# EAGLE design GatewayVote_V2.0 (EAGLE 9.6.1)
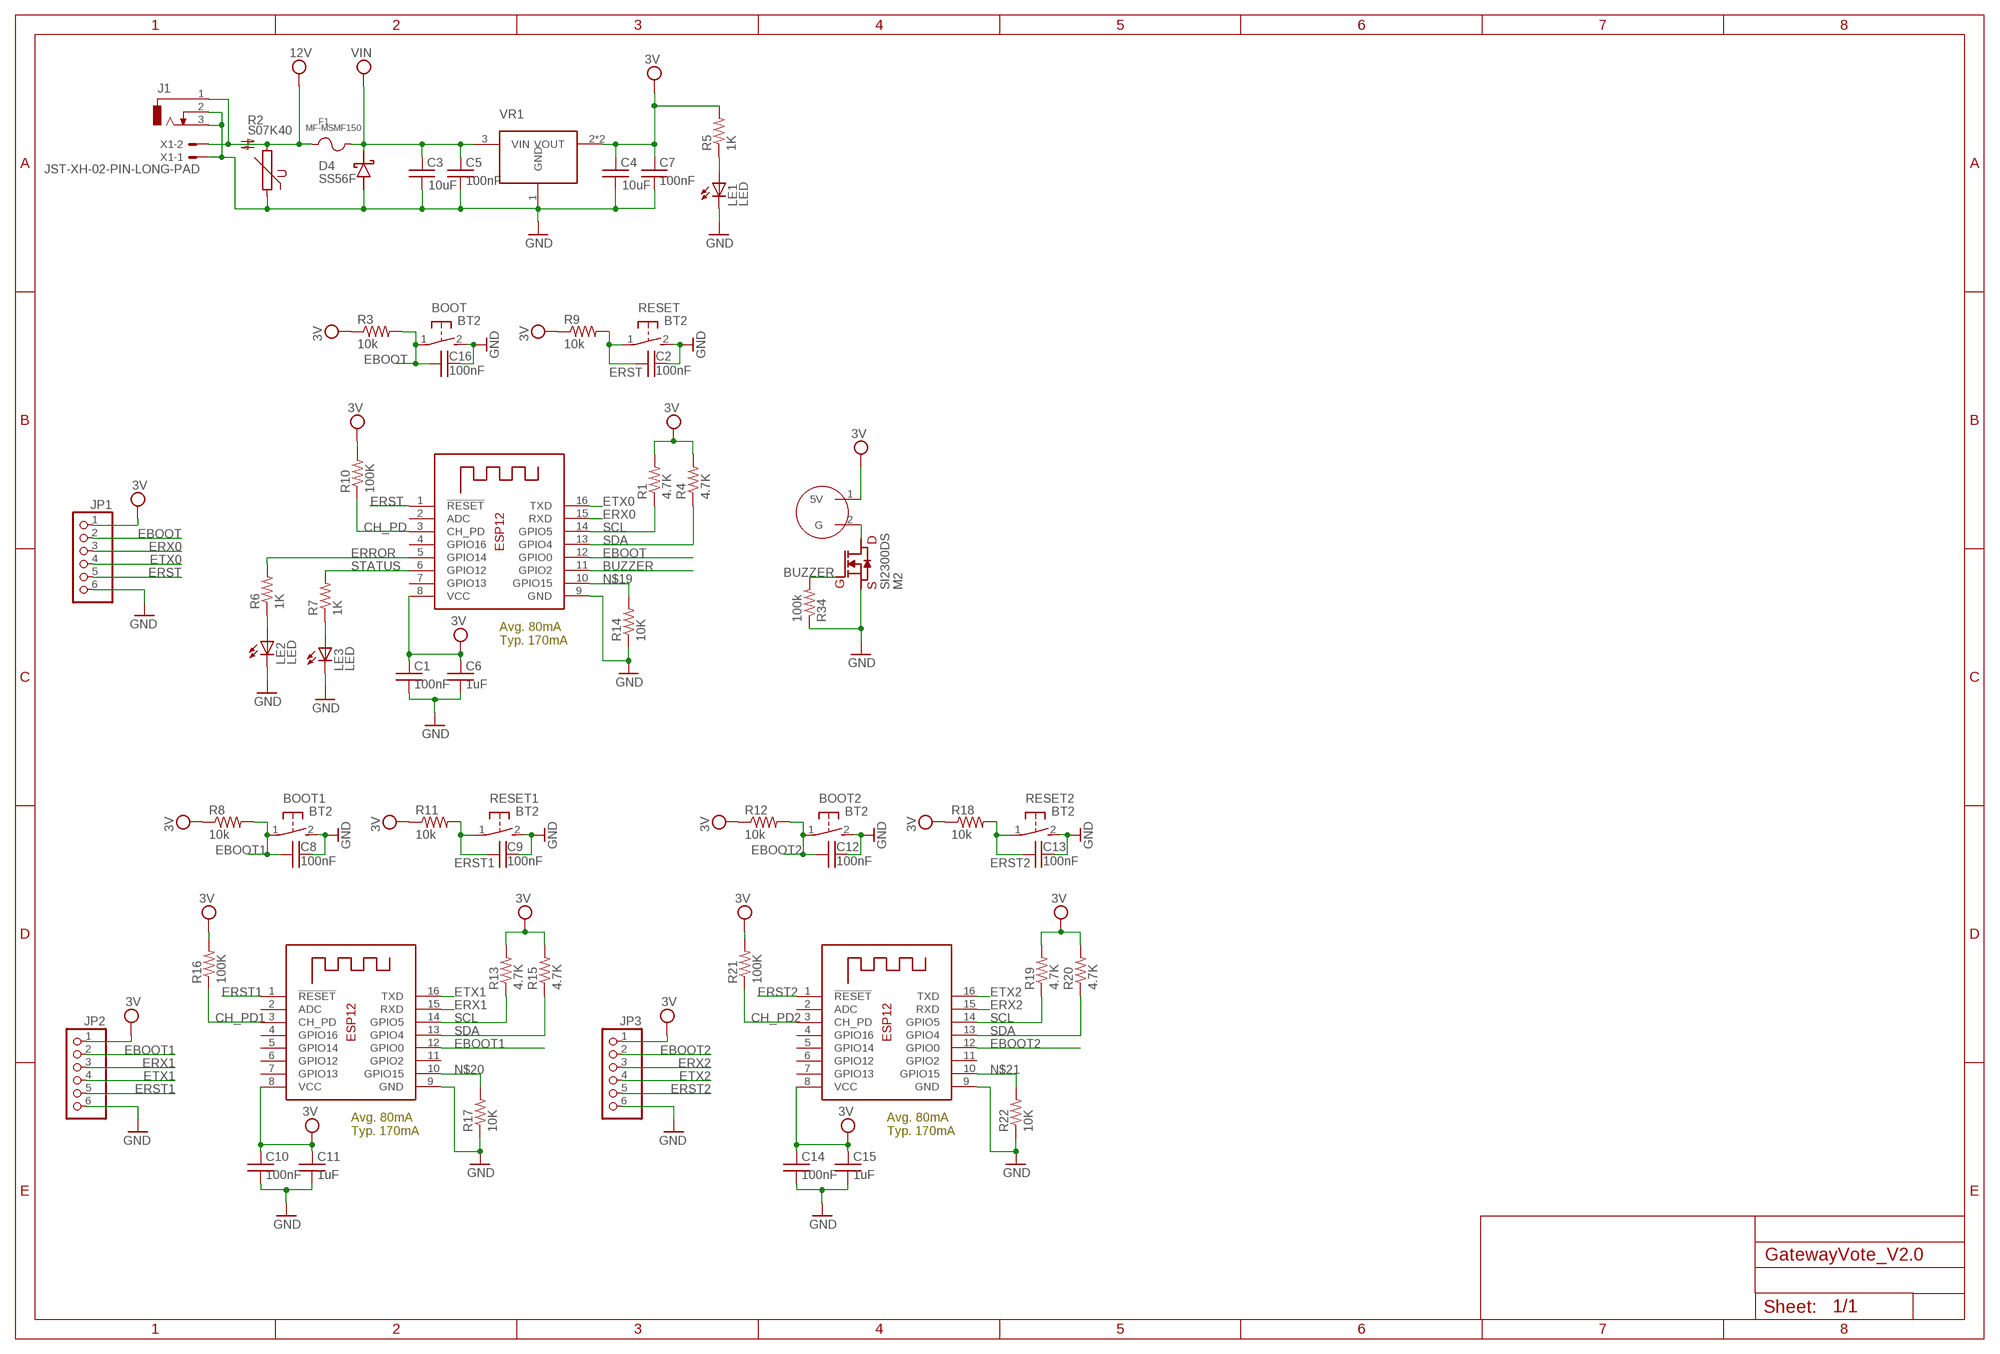
[diagram p0: schematic, sheet 1]

## Parts
BOOT  BT2  [BT2]
BOOT1  BT2  [BT2]
BOOT2  BT2  [BT2]
C1  100nF  C0603  [0603]
C2  100nF  C0603  [0603]
C3  10uF  C0603  [0603]
C4  10uF  C0603  [0603]
C5  100nF  C0603  [0603]
C6  1uF  C0603  [0603]
C7  100nF  C0603  [0603]
C8  100nF  C0603  [0603]
C9  100nF  C0603  [0603]
C10  100nF  C0603  [0603]
C11  1uF  C0603  [0603]
C12  100nF  C0603  [0603]
C13  100nF  C0603  [0603]
C14  100nF  C0603  [0603]
C15  1uF  C0603  [0603]
C16  100nF  C0603  [0603]
D4  SS56F  [SMB]
F1  MF-MSMF150  [FUSER_MF-MSMF150]
J1  DCJ0303  [DCJ0303]
JP1  PINHD-1X6  [1X06]
JP2  PINHD-1X6  [1X06]
JP3  PINHD-1X6  [1X06]
LE1  LED  [LED3MM]
LE2  LED  [LED3MM]
LE3  LED  [LED3MM]
M2  SI2300DS  MOSFETN  [SOT23(1)]
R1  4.7K  R0603  [0603]
R2  S07K40  [S07K40]
R3  10k  R0603  [0603]
R4  4.7K  R0603  [0603]
R5  1K  R0603  [0603]
R6  1K  R0603  [0603]
R7  1K  R0603  [0603]
R8  10k  R0603  [0603]
R9  10k  R0603  [0603]
R10  100K  R0603  [0603]
R11  10k  R0603  [0603]
R12  10k  R0603  [0603]
R13  4.7K  R0603  [0603]
R14  10K  R0603  [0603]
R15  4.7K  R0603  [0603]
R16  100K  R0603  [0603]
R17  10K  R0603  [0603]
R18  10k  R0603  [0603]
R19  4.7K  R0603  [0603]
R20  4.7K  R0603  [0603]
R21  100K  R0603  [0603]
R22  10K  R0603  [0603]
R34  100k  R0603  [0603]
RESET  BT2  [BT2]
RESET1  BT2  [BT2]
RESET2  BT2  [BT2]
U$3  BUZZER-5V  [BUZZER-5V]
VR1  LD1085D2M33R  [VREG_LD1085D2M33R]
X1  JST-XH-02-PIN-LONG-PAD  [JST-XH-02-PACKAGE-LONG-PAD]
X2  ESP-12  [ESP-12]
X3  ESP-12  [ESP-12]
X4  ESP-12  [ESP-12]

## Nets
3V: C1.1 C4.1 C6.1 C7.1 C10.1 C11.1 C14.1 C15.1 JP1.1 JP2.1 JP3.1 R1.2 R3.1 R4.2 R5.2 R8.1 R9.1 R10.2 R11.1 R12.1 R13.2 R15.2 R16.2 R18.1 R19.2 R20.2 R21.2 U$3.1(5V) VR1.2(VOUT) VR1.4(VOUT) X2.8(VCC) X3.8(VCC) X4.8(VCC)
12V: F1.1 J1.1 R2.2 X1.2
BUZZER: M2.1(G) R34.2 X2.11(GPIO2)
CH_PD: R10.1 X2.3(CH_PD)
CH_PD1: R16.1 X3.3(CH_PD)
CH_PD2: R21.1 X4.3(CH_PD)
EBOOT: BOOT.1 C16.1 JP1.2 R3.2 X2.12(GPIO0)
EBOOT1: BOOT1.1 C8.1 JP2.2 R8.2 X3.12(GPIO0)
EBOOT2: BOOT2.1 C12.1 JP3.2 R12.2 X4.12(GPIO0)
ERROR: R6.2 X2.5(GPIO14)
ERST: C2.1 JP1.5 R9.2 RESET.1 X2.1(!RESET)
ERST1: C9.1 JP2.5 R11.2 RESET1.1 X3.1(!RESET)
ERST2: C13.1 JP3.5 R18.2 RESET2.1 X4.1(!RESET)
ERX0: JP1.3 X2.15(RXD)
ERX1: JP2.3 X3.15(RXD)
ERX2: JP3.3 X4.15(RXD)
ETX0: JP1.4 X2.16(TXD)
ETX1: JP2.4 X3.16(TXD)
ETX2: JP3.4 X4.16(TXD)
GND: BOOT1.2 BOOT2.2 BOOT.2 C1.2 C2.2 C3.2 C4.2 C5.2 C6.2 C7.2 C8.2 C9.2 C10.2 C11.2 C12.2 C13.2 C14.2 C15.2 C16.2 D4.A J1.2 J1.3 JP1.6 JP2.6 JP3.6 LE1.K(C) LE2.K(C) LE3.K(C) M2.2(S) R2.1 R14.1 R17.1 R22.1 R34.1 RESET1.2 RESET2.2 RESET.2 VR1.1(GND) X1.1 X2.9(GND) X3.9(GND) X4.9(GND)
N$1: M2.3(D) U$3.2(G)
N$3: LE2.A R6.1
N$5: LE3.A R7.1
N$19: R14.2 X2.10(GPIO15)
N$20: R17.2 X3.10(GPIO15)
N$21: R22.2 X4.10(GPIO15)
N$36: LE1.A R5.1
SCL: R1.1 R13.1 R19.1 X2.14(GPIO5) X3.14(GPIO5) X4.14(GPIO5)
SDA: R4.1 R15.1 R20.1 X2.13(GPIO4) X3.13(GPIO4) X4.13(GPIO4)
STATUS: R7.2 X2.6(GPIO12)
VIN: C3.1 C5.1 D4.C F1.2 VR1.3(VIN)
Unconnected: X2.2(ADC) X2.4(GPIO16) X2.7(GPIO13) X3.2(ADC) X3.4(GPIO16) X3.5(GPIO14) X3.6(GPIO12) X3.7(GPIO13) X3.11(GPIO2) X4.2(ADC) X4.4(GPIO16) X4.5(GPIO14) X4.6(GPIO12) X4.7(GPIO13) X4.11(GPIO2)

## Notes on the sheet
- Avg. 80mA
  Typ. 170mA
- Avg. 80mA
  Typ. 170mA
- Avg. 80mA
  Typ. 170mA

## Library data of the parts
BOOT BOOT1 BOOT2 RESET RESET1 RESET2 = Uy_SMD:BT2
C1 C6 C10 C11 C14 C15 = An:C0603
C2 C8 C9 C12 C13 C16 = Dkoi:C0603
C3-C5 C7 = Dkoi-updated:C0603
D4 = Dkoi:SS56F
F1 = Uy_SMD:MF-MSMF150; AVAILABILITY: Unavailable; DESCRIPTION: Polymeric PTC Resettable Fuse 24V 1.5A Ih Surface Mount 1812 (4532 Metric), Concave; MF: Bourns; MP: MF-MSMF150; PACKAGE: None; PRICE: None
J1 = con-jack:DCJ0303: DC POWER JACK Source: DCJ0303.pdf; OC_FARNELL: unknown; OC_NEWARK: unknown
JP1-JP3 = pinhead:PINHD-1X6: PIN HEADER
LE1-LE3 = Dkoi:LED
M2 = Dkoi:MOSFETN
R1 R4-R7 R10 R13-R17 R19-R22 = Dkoi-updated:R0603
R2 = varistor:S07K40: VARISTOR
R3 R8 R9 R11 R12 R18 R34 = Dkoi:R0603
U$3 = Uy_DIP:BUZZER-5V
VR1 = Uy_SMD:LD1085D2M33R: Check availability <https://pricing.snapeda.com/parts/LD1085D2M33R/STMicroelectronics/view-part?ref=eda>; AVAILABILITY: In Stock; DESCRIPTION: Linear Voltage Regulator IC Positive Fixed 1 Output 3A D2PAK-3; MF: STMicroelectronics; MP: LD1085D2M33R; PACKAGE: D2PAK STMicroelectronics; PRICE: None; PURCHASE-URL: https://pricing.snapeda.com/search?q=LD1085D2M33R&ref=eda
X1 = JST XH Connectors v1-0:JST-XH-02-PIN: JST XH Connector 2 Pin Wire to board connector. Pitch: 2,54 mm, (0.100") Number of pins: 2 Created by Rembrandt Electronics www.rembrandtelectronics.com
X2-X4 = An:ESP-12

## Board
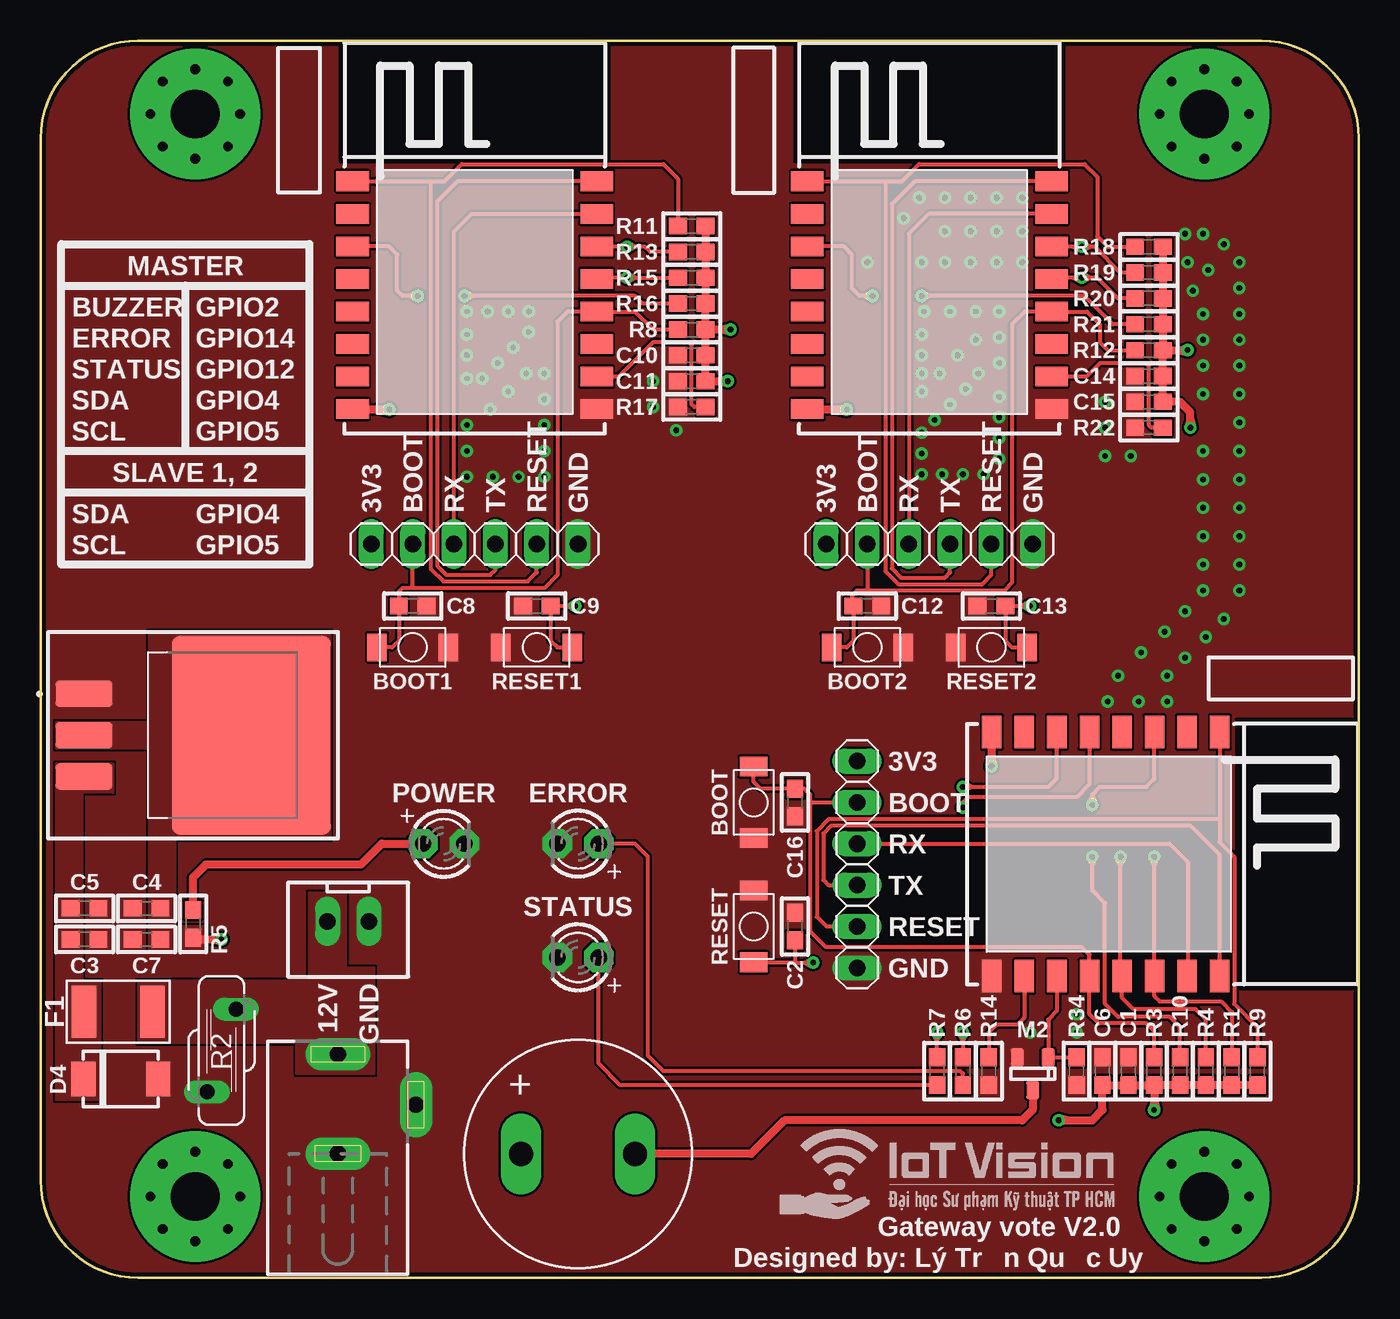
[diagram p1: board, top side]
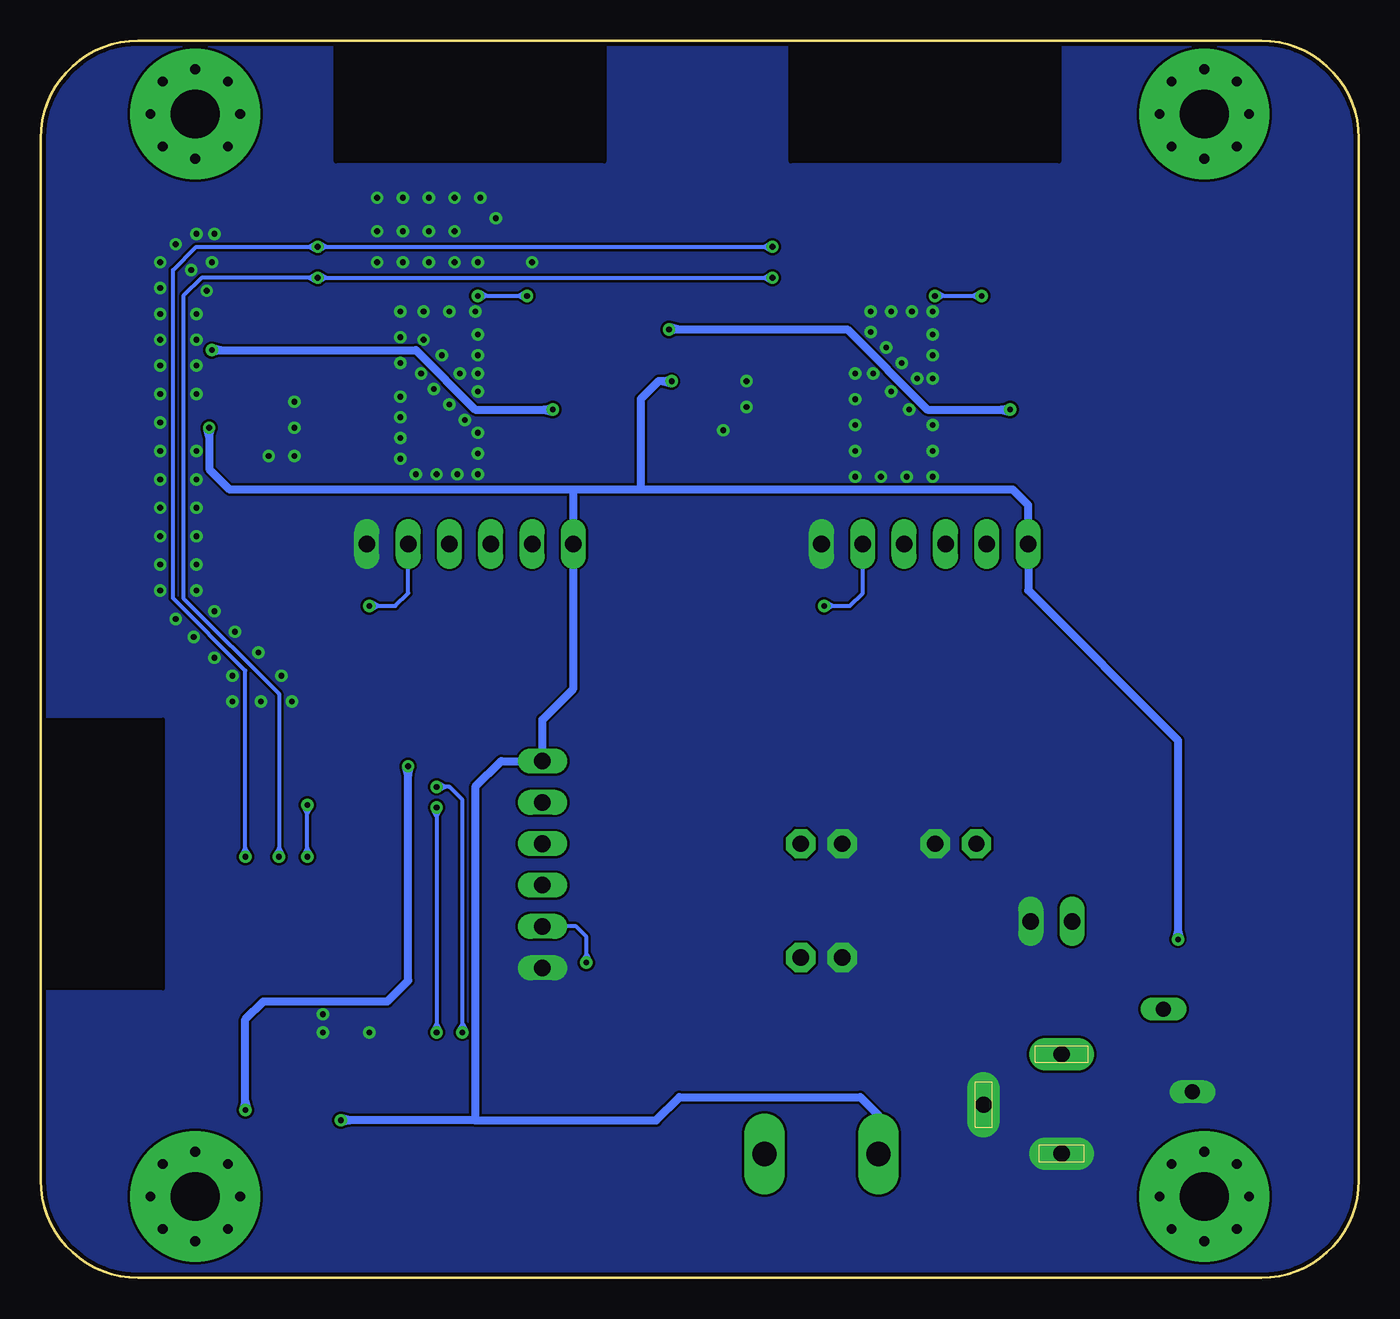
[diagram p2: board, bottom side, seen from below]

Size 81 x 76 mm. Coordinates in mm from the lower left corner, seen from the top.
Outline: 0,70 0,6 arc90 6,0 75,0 arc90 81,6 81,70 arc90 75,76 6,76 arc90 0,70
Copper layers (1*16): Top 0.035mm / dielectric 1.6mm / Bottom 0.035mm
Design rules "Dkoi": minimum track width 0.15mm, minimum drill 0.3mm, track to track 0.15mm, track to pad 0.15mm, pad to pad 0.15mm, via to via 0.15mm, smd to smd 0mil, copper to edge 0.25mm, drill to drill 0.15mm, minimum pad ring 10mil, minimum via ring 8mil, stop-mask expansion 4mil, vias tented up to drill 0.5mm, thermal gap 10mil

### Footprints (pad centres in the part's own frame; a part is rotated, then mirrored left to right if it is on the bottom)
BT2 = smd 1.2 x 1.7: 1 -2.2,0; 2 2.2,0
0603 = smd 1.1 x 1: 1 -0.85,0; 2 0.85,0
SMB = smd 1.5 x 2.1: A -2.3,0; C 2.3,0
FUSER_MF-MSMF150 = smd 1.5 x 3.2: 1 -2.1,0; 2 2.1,0
DCJ0303 = drill 1 pad 2 long: 1 0,3.1; 2 4.8,0; 3 0,-3
1X06 = drill 1.016 long: 1 -6.35,0; 2 -3.81,0; 3 -1.27,0; 4 1.27,0; 5 3.81,0; 6 6.35,0
LED3MM = drill 1 pad 1.8 octagon: A -1.27,0; K 1.27,0
SOT23(1) = smd 0.8 x 1.1: 1 -0.95,-1; 2 0.95,-1; 3 0,1
S07K40 = drill 0.914 long: 1 -0.889,-2.54; 2 0.889,2.54
BUZZER-5V = drill 1.5 pad 2.5 long: 1 -3.5,0; 2 3.5,0
VREG_LD1085D2M33R = smd 3.5 x 1.6: 1 -6.7,2.54; 2 -6.7,0; 3 -6.7,-2.54 | smd 9.75 x 12.2: 4 3.575,0
JST-XH-02-PACKAGE-LONG-PAD = drill 1.016 long: 1 -1.27,0; 2 1.27,0
ESP-12 = smd 2 x 1.2: 1 -7.5,4.5; 2 -7.5,2.5; 3 -7.5,0.5; 4 -7.5,-1.5; 5 -7.5,-3.5; 6 -7.5,-5.5; 7 -7.5,-7.5; 8 -7.5,-9.5; 9 7.5,-9.5; 10 7.5,-7.5; 11 7.5,-5.5; 12 7.5,-3.5; 13 7.5,-1.5; 14 7.5,0.5; 15 7.5,2.5; 16 7.5,4.5

### Placement (x,y rotation side)
BOOT  43.81,29.21 270 top
BOOT1  22.86,38.73 0 top
BOOT2  50.8,38.73 0 top
C1  66.83,12.7 90 top
C2  46.35,21.59 90 top
C3  2.7,20.8 0 top
C4  6.51,22.7 180 top
C5  2.7,22.7 0 top
C6  65.25,12.7 90 top
C7  6.51,20.8 180 top
C8  22.86,41.27 0 top
C9  30.48,41.27 180 top
C10  40.01,56.67 180 top
C11  40.01,55.09 180 top
C12  50.8,41.27 0 top
C13  58.42,41.27 180 top
C14  68.1,55.4 180 top
C15  68.1,53.82 180 top
C16  46.35,29.21 270 top
D4  4.92,12.22 180 top
F1  4.76,16.35 180 top
J1  18.26,10.64 0 top
JP1  50.16,25.4 270 top
JP2  26.67,45.09 0 top
JP3  54.61,45.09 0 top
LE1  24.77,26.67 0 top
LE2  33.02,26.67 180 top
LE3  33.02,19.68 180 top
M2  60.96,12.54 180 top
R1  73.18,12.7 270 top
R2  11.11,13.97 0 top
R3  68.42,12.7 90 top
R4  71.6,12.7 270 top
R5  9.37,21.75 270 top
R6  56.67,12.7 90 top
R7  55.09,12.7 90 top
R8  40.01,58.26 180 top
R9  74.77,12.7 90 top
R10  70.01,12.7 270 top
R11  40.01,64.61 180 top
R12  68.1,56.99 180 top
R13  40.01,63.02 0 top
R14  58.26,12.7 90 top
R15  40.01,61.44 0 top
R16  40.01,59.85 0 top
R17  40.01,53.5 0 top
R18  68.1,63.34 180 top
R19  68.1,61.75 0 top
R20  68.1,60.17 0 top
R21  68.1,58.58 0 top
R22  68.1,52.23 0 top
R34  63.66,12.7 90 top
RESET  43.81,21.59 90 top
RESET1  30.48,38.73 180 top
RESET2  58.42,38.73 180 top
U$2  [1.2MIL]  45.4,3.65 0 top
U$3  33.02,7.62 0 top
VR1  9.37,33.34 0 top
X1  18.89,21.91 180 top
X2  67.94,26.04 270 top
X3  26.67,62.87 0 top
X4  54.61,62.87 0 top

### Tracks (layer width: path | path; a pad name or v marks a point on that pad's centre or on a via)
3V  (via drill 0.35)
  Top 0.5: X2.8 58.42,33.51 58.42,31.96 | 58.42,31.96 v58.42,31.43 | R3.1 R10.2 R4.2 R1.2 R9.1 | R18.1 R19.2 R20.2 R21.2 R12.1 | R12.1 69.96,56.99 | 69.96,56.99 v70.48,56.99 | v49.53,53.34 49.01,53.34 | 49.01,53.34 47.13,53.34 X4.8 | R8.1 C10.1 C11.1 41.7,55.09 | R8.1 R16.2 R15.2 R13.2 R11.1 | 41.7,55.09 v42.23,55.09 | R8.1 41.86,58.26 | 41.86,58.26 v42.39,58.26 | v21.43,53.34 20.91,53.34 | 20.91,53.34 19.2,53.34 X3.8 | v70.64,52.23 70.64,52.75 | 70.64,52.75 70.64,53.18 70.01,53.82 C15.1 C14.1 R12.1 | v62.55,9.68 63.07,9.68 | 63.07,9.68 64.61,9.68 65.25,10.32 C6.1 C1.1 R3.1 | R3.1 68.42,10.84 | 68.42,10.84 v68.42,10.32 | R5.2 9.47,20.8 10.59,20.8 | 10.59,20.8 v11.11,20.8 | 58.42,31.96 58.3,31.46 v58.42,31.43 | 58.42,31.96 58.54,31.46 v58.42,31.43 | 69.96,56.99 70.45,56.87 v70.48,56.99 | 69.96,56.99 70.45,57.12 v70.48,56.99 | 49.01,53.34 49.5,53.22 v49.53,53.34 | 49.01,53.34 49.5,53.46 v49.53,53.34 | 41.7,55.09 42.2,54.96 v42.23,55.09 | 41.7,55.09 42.2,55.21 v42.23,55.09 | 41.86,58.26 42.35,58.14 v42.39,58.26 | 41.86,58.26 42.35,58.39 v42.39,58.26 | 20.91,53.34 21.4,53.22 v21.43,53.34 | 20.91,53.34 21.4,53.46 v21.43,53.34 | 70.64,52.75 70.52,52.26 v70.64,52.23 | 70.64,52.75 70.77,52.26 v70.64,52.23 | 63.07,9.68 62.58,9.81 v62.55,9.68 | 63.07,9.68 62.58,9.56 v62.55,9.68 | 68.42,10.84 68.3,10.35 v68.42,10.32 | 68.42,10.84 68.55,10.35 v68.42,10.32 | 10.59,20.8 11.08,20.67 v11.11,20.8 | 10.59,20.8 11.08,20.92 v11.11,20.8
  Bottom 0.5: 58.42,30.91 58.42,18.26 59.69,16.99 67.31,16.99 68.42,15.88 68.42,10.84 | 58.42,30.91 v58.42,31.43 | 54.29,9.68 54.29,30.16 52.7,31.75 JP1.1 50.16,34.29 48.26,36.2 JP3.1 48.26,48.42 | 54.29,9.68 43.18,9.68 41.75,11.11 30.64,11.11 29.52,9.99 U$3.1 | 44.13,48.42 21.27,48.42 20.32,47.47 JP2.1 20.32,42.23 11.11,33.02 11.11,21.32 | 44.13,48.42 48.26,48.42 | v70.48,56.99 69.96,56.99 | 69.96,56.99 57.94,56.99 54.29,53.34 50.05,53.34 | 50.05,53.34 v49.53,53.34 | 48.26,48.42 69.37,48.42 70.64,49.69 70.64,51.7 | v42.23,55.09 42.75,55.09 | 42.75,55.09 43.02,55.09 44.13,53.98 44.13,48.42 | v42.39,58.26 41.86,58.26 | 41.86,58.26 31.43,58.26 26.51,53.34 21.96,53.34 | 21.96,53.34 v21.43,53.34 | v70.64,52.23 70.64,51.7 | 54.29,9.68 62.02,9.68 | 62.02,9.68 v62.55,9.68 | v68.42,10.32 68.42,10.84 | 11.11,21.32 v11.11,20.8 | 58.42,30.91 58.54,31.4 v58.42,31.43 | 58.42,30.91 58.3,31.4 v58.42,31.43 | 69.96,56.99 70.45,56.87 v70.48,56.99 | 69.96,56.99 70.45,57.12 v70.48,56.99 | 50.05,53.34 49.56,53.46 v49.53,53.34 | 50.05,53.34 49.56,53.22 v49.53,53.34 | 42.75,55.09 42.26,55.21 v42.23,55.09 | 42.75,55.09 42.26,54.96 v42.23,55.09 | 41.86,58.26 42.35,58.14 v42.39,58.26 | 41.86,58.26 42.35,58.39 v42.39,58.26 | 21.96,53.34 21.46,53.46 v21.43,53.34 | 21.96,53.34 21.46,53.22 v21.43,53.34 | 70.64,51.7 70.77,52.2 v70.64,52.23 | 70.64,51.7 70.52,52.2 v70.64,52.23 | 62.02,9.68 62.52,9.56 v62.55,9.68 | 62.02,9.68 62.52,9.81 v62.55,9.68 | 68.42,10.84 68.3,10.35 v68.42,10.32 | 68.42,10.84 68.55,10.35 v68.42,10.32 | 11.11,21.32 10.99,20.83 v11.11,20.8 | 11.11,21.32 11.24,20.83 v11.11,20.8
  pour Top (no thermals): 0.95,32.54 6.67,32.54 6.67,20.16 10.16,20.16 10.16,21.59 8.26,21.59 8.26,26.99 17.78,26.99 17.78,39.69 6.67,39.69 6.67,34.13 0.95,34.13
12V
  pour Top (no thermals): 20.48,12.54 15.72,12.54 15.72,14.45 6.03,14.45 6.03,18.26 16.51,18.26 16.51,23.65 18.73,23.65 18.73,19.05 20.48,19.05
BUZZER
  Top 0.25: X2.11 62.45,16.41 61.91,15.87 M2.1 R34.2
CH_PD  (via drill 0.35)
  Top 0.25: 64.61,25.35 64.61,23.81 65.41,23.02 65.41,16.83 66.2,16.03 69.37,16.03 70.01,15.4 R10.1 | 64.61,25.35 v64.61,25.88 | v64.61,29.05 64.61,29.58 | 64.61,29.58 64.61,29.69 65.09,30.16 67.94,30.16 68.44,30.66 X2.3 | 64.61,25.35 64.83,25.75 v64.61,25.88 | 64.61,25.35 64.39,25.75 v64.61,25.88 | 64.61,29.58 64.39,29.17 v64.61,29.05 | 64.61,29.58 64.83,29.17 v64.61,29.05
  Bottom 0.25: v64.61,25.88 64.61,26.4 | 64.61,26.4 64.61,28.53 | 64.61,28.53 v64.61,29.05 | 64.61,26.4 64.39,26 v64.61,25.88 | 64.61,26.4 64.83,26 v64.61,25.88 | 64.61,28.53 64.83,28.93 v64.61,29.05 | 64.61,28.53 64.39,28.93 v64.61,29.05
CH_PD1  (via drill 0.35)
  Top 0.25: R16.1 36.99,59.85 36.51,60.33 26.58,60.33 | v23.18,60.33 22.65,60.33 | 22.65,60.33 22.23,60.33 21.91,60.64 21.91,62.87 21.41,63.37 X3.3 | 26.58,60.33 v26.05,60.33 | 26.58,60.33 26.18,60.55 v26.05,60.33 | 26.58,60.33 26.18,60.1 v26.05,60.33 | 22.65,60.33 23.05,60.1 v23.18,60.33 | 22.65,60.33 23.05,60.55 v23.18,60.33
  Bottom 0.25: v26.05,60.33 25.53,60.33 | 25.53,60.33 23.7,60.33 | 23.7,60.33 v23.18,60.33 | 25.53,60.33 25.93,60.1 v26.05,60.33 | 25.53,60.33 25.93,60.55 v26.05,60.33 | 23.7,60.33 23.3,60.55 v23.18,60.33 | 23.7,60.33 23.3,60.1 v23.18,60.33
CH_PD2  (via drill 0.35)
  Top 0.25: R21.1 65.88,58.58 64.14,60.33 54.66,60.33 | v51.12,60.33 50.59,60.33 | 50.59,60.33 50.32,60.33 49.85,60.8 49.85,62.87 49.35,63.37 X4.3 | 54.66,60.33 v54.13,60.33 | 54.66,60.33 54.26,60.55 v54.13,60.33 | 54.66,60.33 54.26,60.1 v54.13,60.33 | 50.59,60.33 50.99,60.1 v51.12,60.33 | 50.59,60.33 50.99,60.55 v51.12,60.33
  Bottom 0.25: v54.13,60.33 53.61,60.33 | 53.61,60.33 51.64,60.33 | 51.64,60.33 v51.12,60.33 | 53.61,60.33 54.01,60.1 v54.13,60.33 | 53.61,60.33 54.01,60.55 v54.13,60.33 | 51.64,60.33 51.24,60.55 v51.12,60.33 | 51.64,60.33 51.24,60.1 v51.12,60.33
EBOOT
  Top 0.25: 47.3,29.21 JP1.2 | 47.3,29.21 47.3,21.28 48.26,20.32 63.98,20.32 64.44,19.85 X2.12 64.44,16.2 65.01,15.63 67.94,15.63 68.42,15.16 R3.2 | 47.3,29.21 47.3,29.69 46.93,30.06 C16.1 44.23,30.06 43.81,30.48 BOOT.1
EBOOT1
  Top 0.25: 22.86,42.38 JP2.2 | 22.86,42.38 30.95,42.38 31.75,43.18 31.75,58.74 32.38,59.37 X3.12 36.52,59.37 37.62,58.26 R8.2 | 22.86,42.38 22.22,42.38 22.01,42.17 C8.1 22.01,39.16 21.59,38.73 BOOT1.1
EBOOT2
  Top 0.25: JP3.2 50.8,42.22 | 50.8,42.22 59.21,42.22 59.69,42.7 59.69,58.58 60.48,59.37 X4.12 64.3,59.37 65.09,58.58 65.09,57.47 65.56,56.99 R12.2 | 50.8,42.22 50.16,42.22 49.85,41.91 49.85,41.38 C12.1 49.95,39.16 49.53,38.73 BOOT2.1
ERROR  (via drill 0.35)
  Top 0.25: X2.5 64.44,30.31 63.66,29.53 56.99,29.53 56.85,29.39 | v56.67,15.08 56.67,14.56 | 56.67,14.56 R6.2 | 56.85,29.39 56.67,29.21 v56.67,28.89 | 56.85,29.39 56.51,29.08 v56.67,28.89 | 56.85,29.39 56.92,28.93 v56.67,28.89 | 56.67,14.56 56.9,14.96 v56.67,15.08 | 56.67,14.56 56.45,14.96 v56.67,15.08
  Bottom 0.25: v56.67,28.89 56.67,28.37 | 56.67,28.37 56.67,15.61 | 56.67,15.61 v56.67,15.08 | 56.67,28.37 56.9,28.77 v56.67,28.89 | 56.67,28.37 56.45,28.77 v56.67,28.89 | 56.67,15.61 56.45,15.2 v56.67,15.08 | 56.67,15.61 56.9,15.2 v56.67,15.08
ERST  (via drill 0.35)
  Top 0.25: X2.1 72.44,28.17 | JP1.5 48.29,21.59 47.7,22.18 47.7,27.45 48.42,28.17 72.44,28.17 | RESET.1 46.35,19.39 | C2.1 46.35,19.39 | 46.35,19.39 46.38,19.37 46.94,19.37 | 46.94,19.37 v47.47,19.37 | 72.44,28.17 72.44,26.77 73.34,25.88 73.34,16.83 74.77,15.4 R9.2 | 46.94,19.37 47.34,19.15 v47.47,19.37 | 46.94,19.37 47.34,19.59 v47.47,19.37
  Bottom 0.25: v47.47,19.37 47.47,19.89 | 47.47,19.89 47.47,20.95 48.1,21.59 JP1.5 | 47.47,19.89 47.24,19.49 v47.47,19.37 | 47.47,19.89 47.69,19.49 v47.47,19.37
ERST1  (via drill 0.35)
  Top 0.25: X3.1 23.96,67.36 | JP2.5 30.48,43.34 29.92,42.78 24.76,42.78 23.96,43.58 23.96,67.36 | 23.96,67.36 24.82,67.36 25.88,68.42 38.26,68.42 39.16,67.53 R11.2 | RESET1.1 31.75,38.73 31.33,39.16 C9.1 32.34,41.27 | 32.34,41.27 v32.86,41.27 | 32.34,41.27 32.74,41.05 v32.86,41.27 | 32.34,41.27 32.74,41.5 v32.86,41.27
  Bottom 0.25: v32.86,41.27 32.34,41.27 | 32.34,41.27 31.27,41.27 30.48,42.07 JP2.5 | 32.34,41.27 32.74,41.05 v32.86,41.27 | 32.34,41.27 32.74,41.5 v32.86,41.27
ERST2  (via drill 0.35)
  Top 0.25: X4.1 51.9,67.36 | JP3.5 58.42,43.18 57.86,42.62 52.7,42.62 51.9,43.42 51.9,67.36 | 51.9,67.36 52.92,67.36 53.98,68.42 64.14,68.42 64.93,67.63 64.93,63.98 65.56,63.34 R18.2 | RESET2.1 59.69,38.73 59.27,39.16 C13.1 60.28,41.27 | 60.28,41.27 v60.8,41.27 | 60.28,41.27 60.68,41.05 v60.8,41.27 | 60.28,41.27 60.68,41.5 v60.8,41.27
  Bottom 0.25: v60.8,41.27 60.28,41.27 | 60.28,41.27 59.21,41.27 58.42,42.07 JP3.5 | 60.28,41.27 60.68,41.05 v60.8,41.27 | 60.28,41.27 60.68,41.5 v60.8,41.27
ERX0
  Top 0.25: JP1.3 69.37,26.67 70.48,25.56 70.48,18.57 X2.15
ERX1
  Top 0.25: JP2.3 25.4,64.29 26.47,65.36 X3.15
ERX2
  Top 0.25: X4.15 54.57,65.36 53.34,64.14 JP3.3
ETX0
  Top 0.25: X2.16 72.44,25.98 70.66,27.76 48.58,27.76 48.1,27.29 48.1,24.45 48.42,24.13 JP1.4
ETX1
  Top 0.25: X3.16 25.61,67.36 24.36,66.11 24.36,43.74 24.92,43.18 27.62,43.18 27.94,43.5 JP2.4
ETX2
  Top 0.25: X4.16 53.71,67.36 52.3,65.96 52.3,43.58 52.86,43.02 55.56,43.02 55.88,43.34 JP3.4
GND  (via drill 0.35)
  other vias: 69.22,35.4 69.22,36.99 66.2,36.99 67.47,35.4 65.56,35.4 70.33,38.1 67.63,38.42 69.06,39.69 71.6,39.37 72.71,40.48 70.33,40.96 71.44,42.23 73.66,42.23 73.66,43.81 71.44,43.81 73.66,45.56 71.44,45.56 73.66,47.31 71.44,47.31 71.44,49.05 73.66,49.05 71.44,50.8 73.66,50.8 73.66,52.55 73.66,54.29 71.44,54.29 71.44,56.04 73.66,56.04 54.13,54.45 55.24,55.56 56.36,56.67 57.47,57.63 58.9,57.78 58.9,56.2 57.63,55.56 56.83,54.61 55.88,53.66 54.93,52.7 54.13,51.91 54.13,50.64 54.13,49.37 55.4,49.37 56.67,49.37 57.94,49.37 58.9,50.32 58.9,59.37 57.47,59.37 55.88,59.37 54.29,59.37 54.13,57.94 54.13,56.67 54.13,55.56 58.9,51.59 58.9,52.86 58.9,54.13 26.19,59.37 27.46,59.37 28.73,59.37 30,59.37 30,58.1 29.05,57.15 28.1,56.2 27.15,55.24 26.19,55.24 26.19,57.94 26.19,56.67 26.19,52.39 26.19,50.8 26.19,49.21 27.78,49.21 29.37,49.21 30.96,49.21 30.96,50.8 30.96,52.39 30.96,53.98 30.96,55.56 29.84,55.56 28.73,54.45 27.62,53.34 73.66,57.63 71.44,57.63 73.66,59.21 71.44,59.21 73.66,60.8 73.66,62.39 72.71,63.5 71.44,64.14 70.33,64.14 70.8,60.64 70.48,62.39 71.75,61.91 60.33,62.39 58.74,62.39 57.15,62.39 55.56,62.39 54.13,62.39 60.33,64.29 58.74,64.29 57.15,64.29 55.56,64.29 50.8,62.39 65.41,53.82 65.41,52.23 65.41,50.48 66.99,50.48 63.66,15.08 63.66,16.19 60.8,15.08 37.62,53.5 37.62,55.09 39.05,52.07 60.33,66.36 58.74,66.36 57.15,66.36 55.56,66.36 53.98,66.36 53.02,65.09
  pour Top (rank 2, no thermals): 28,76 75,76 arc-90 81,70 81,6 arc-90 75,0 6,0 arc-90 0,6 0,70 arc-90 6,76
  pour Bottom (rank 2, no thermals): 28,76 75,76 arc-90 81,70 81,6 arc-90 75,0 6,0 arc-90 0,6 0,70 arc-90 6,76
  cutout Top: 18.41,76.2 18.41,68.58 34.92,68.58 34.92,76.2
  cutout Bottom: 18.41,76.2 18.41,68.58 34.92,68.58 34.92,76.2
  cutout Bottom: 46.35,76.2 46.35,68.58 62.87,68.58 62.87,76.2
  cutout Top: 46.35,76.2 46.35,68.58 62.87,68.58 62.87,76.2
  cutout Top: 73.5,17.78 81.12,17.78 81.12,34.29 73.5,34.29
  cutout Bottom: 73.5,17.78 81.12,17.78 81.12,34.29 73.5,34.29
N$1
  Top 0.5: M2.3 60.96,10.32 60.33,9.68 45.72,9.68 43.66,7.62 U$3.2
N$2  (via drill 0.6, 3 pad 8)
  Top 0.25: v71.5,71.5 71.5,73.35 | 71.5,73.35 v71.5,74.25 | v71.5,71.5 72.86,72.86 | 72.86,72.86 v73.5,73.5 | v71.5,71.5 73.35,71.5 | 73.35,71.5 v74.25,71.5 | v71.5,71.5 72.86,70.14 | 72.86,70.14 v73.5,69.5 | v71.5,71.5 71.5,69.65 | 71.5,69.65 v71.5,68.75 | v71.5,71.5 70.14,70.14 | 70.14,70.14 v69.5,69.5 | v71.5,71.5 69.65,71.5 | 69.65,71.5 v68.75,71.5 | v71.5,71.5 70.14,72.86 | 70.14,72.86 v69.5,73.5 | 70.14,70.14 69.37,69.86 v69.5,69.5 | 70.14,70.14 69.86,69.37 v69.5,69.5 | 69.65,71.5 68.91,71.84 v68.75,71.5 | 69.65,71.5 68.91,71.16 v68.75,71.5 | 70.14,72.86 69.86,73.63 v69.5,73.5 | 70.14,72.86 69.37,73.14 v69.5,73.5 | 71.5,73.35 71.84,74.09 v71.5,74.25 | 71.5,73.35 71.16,74.09 v71.5,74.25 | 72.86,72.86 73.63,73.14 v73.5,73.5 | 72.86,72.86 73.14,73.63 v73.5,73.5 | 73.35,71.5 74.09,71.16 v74.25,71.5 | 73.35,71.5 74.09,71.84 v74.25,71.5 | 72.86,70.14 73.14,69.37 v73.5,69.5 | 72.86,70.14 73.63,69.86 v73.5,69.5 | 71.5,69.65 71.16,68.91 v71.5,68.75 | 71.5,69.65 71.84,68.91 v71.5,68.75
N$3
  Top 0.25: R6.1 56.67,12.54 56.52,12.7 38.26,12.7 37.31,13.65 37.31,25.88 36.51,26.67 LE2.A
N$4  (via drill 0.6, 3 pad 8)
  Top 0.25: v9.5,5 9.5,6.85 | 9.5,6.85 v9.5,7.75 | v9.5,5 10.86,6.36 | 10.86,6.36 v11.5,7 | v9.5,5 11.35,5 | 11.35,5 v12.25,5 | v9.5,5 10.86,3.64 | 10.86,3.64 v11.5,3 | v9.5,5 9.5,3.15 | 9.5,3.15 v9.5,2.25 | v9.5,5 8.14,3.64 | 8.14,3.64 v7.5,3 | v9.5,5 7.65,5 | 7.65,5 v6.75,5 | v9.5,5 8.14,6.36 | 8.14,6.36 v7.5,7 | 8.14,3.64 7.37,3.35 v7.5,3 | 8.14,3.64 7.86,2.87 v7.5,3 | 7.65,5 6.91,5.34 v6.75,5 | 7.65,5 6.91,4.66 v6.75,5 | 8.14,6.36 7.86,7.13 v7.5,7 | 8.14,6.36 7.37,6.64 v7.5,7 | 9.5,6.85 9.84,7.59 v9.5,7.75 | 9.5,6.85 9.16,7.59 v9.5,7.75 | 10.86,6.36 11.63,6.64 v11.5,7 | 10.86,6.36 11.14,7.13 v11.5,7 | 11.35,5 12.09,4.66 v12.25,5 | 11.35,5 12.09,5.34 v12.25,5 | 10.86,3.64 11.14,2.87 v11.5,3 | 10.86,3.64 11.63,3.35 v11.5,3 | 9.5,3.15 9.16,2.41 v9.5,2.25 | 9.5,3.15 9.84,2.41 v9.5,2.25
N$5
  Top 0.25: LE3.A 34.29,13.18 35.62,11.85 R7.1
N$6  (via drill 0.6, 3 pad 8)
  Top 0.25: v71.5,5 71.5,6.85 | 71.5,6.85 v71.5,7.75 | v71.5,5 72.86,6.36 | 72.86,6.36 v73.5,7 | v71.5,5 73.35,5 | 73.35,5 v74.25,5 | v71.5,5 72.86,3.64 | 72.86,3.64 v73.5,3 | v71.5,5 71.5,3.15 | 71.5,3.15 v71.5,2.25 | v71.5,5 70.14,3.64 | 70.14,3.64 v69.5,3 | v71.5,5 69.65,5 | 69.65,5 v68.75,5 | v71.5,5 70.14,6.36 | 70.14,6.36 v69.5,7 | 70.14,3.64 69.37,3.35 v69.5,3 | 70.14,3.64 69.86,2.87 v69.5,3 | 69.65,5 68.91,5.34 v68.75,5 | 69.65,5 68.91,4.66 v68.75,5 | 70.14,6.36 69.86,7.13 v69.5,7 | 70.14,6.36 69.37,6.64 v69.5,7 | 71.5,6.85 71.84,7.59 v71.5,7.75 | 71.5,6.85 71.16,7.59 v71.5,7.75 | 72.86,6.36 73.63,6.64 v73.5,7 | 72.86,6.36 73.14,7.13 v73.5,7 | 73.35,5 74.09,4.66 v74.25,5 | 73.35,5 74.09,5.34 v74.25,5 | 72.86,3.64 73.14,2.87 v73.5,3 | 72.86,3.64 73.63,3.35 v73.5,3 | 71.5,3.15 71.16,2.41 v71.5,2.25 | 71.5,3.15 71.84,2.41 v71.5,2.25
N$10  (via drill 0.6, 3 pad 8)
  Top 0.25: v9.5,71.5 9.5,73.35 | 9.5,73.35 v9.5,74.25 | v9.5,71.5 10.86,72.86 | 10.86,72.86 v11.5,73.5 | v9.5,71.5 11.35,71.5 | 11.35,71.5 v12.25,71.5 | v9.5,71.5 10.86,70.14 | 10.86,70.14 v11.5,69.5 | v9.5,71.5 9.5,69.65 | 9.5,69.65 v9.5,68.75 | v9.5,71.5 7.65,71.5 | 7.65,71.5 v6.75,71.5 | v9.5,71.5 8.14,70.14 | 8.14,70.14 v7.5,69.5 | v9.5,71.5 8.14,72.86 | 8.14,72.86 v7.5,73.5 | 8.14,70.14 7.37,69.86 v7.5,69.5 | 8.14,70.14 7.86,69.37 v7.5,69.5 | 7.65,71.5 6.91,71.84 v6.75,71.5 | 7.65,71.5 6.91,71.16 v6.75,71.5 | 8.14,72.86 7.86,73.63 v7.5,73.5 | 8.14,72.86 7.37,73.14 v7.5,73.5 | 9.5,73.35 9.84,74.09 v9.5,74.25 | 9.5,73.35 9.16,74.09 v9.5,74.25 | 10.86,72.86 11.63,73.14 v11.5,73.5 | 10.86,72.86 11.14,73.63 v11.5,73.5 | 11.35,71.5 12.09,71.16 v12.25,71.5 | 11.35,71.5 12.09,71.84 v12.25,71.5 | 10.86,70.14 11.14,69.37 v11.5,69.5 | 10.86,70.14 11.63,69.86 v11.5,69.5 | 9.5,69.65 9.16,68.91 v9.5,68.75 | 9.5,69.65 9.84,68.91 v9.5,68.75
N$19
  Top 0.25: X2.10 60.45,15.99 60.01,15.56 58.74,15.56 58.26,15.08 R14.2
N$20
  Top 0.25: R17.2 40.16,53.5 40.01,53.66 40.01,57.31 39.85,57.47 37.62,57.47 35.52,55.37 X3.10
N$21
  Top 0.25: R22.2 68.26,52.23 68.1,52.39 68.1,56.04 67.94,56.2 65.09,56.2 64.25,55.37 X4.10
N$36
  Top 0.5: R5.1 9.37,24.61 10.16,25.4 19.68,25.4 20.95,26.67 LE1.A
SCL  (via drill 0.35)
  Top 0.25: 68.42,25.35 68.42,18.56 X2.14 68.44,17.3 68.76,16.99 72.55,16.99 73.21,16.33 73.21,13.57 R1.1 | 68.42,25.35 v68.42,25.88 | v63.98,63.34 63.45,63.34 | 63.45,63.34 62.13,63.34 X4.14 | v36.04,63.34 35.51,63.34 | 35.51,63.34 34.19,63.34 X3.14 | R19.1 66.36,61.75 64.77,63.34 64.5,63.34 | 64.5,63.34 v63.98,63.34 | R13.1 37.47,63.02 37.15,63.34 36.56,63.34 | 36.56,63.34 v36.04,63.34 | 68.42,25.35 68.64,25.75 v68.42,25.88 | 68.42,25.35 68.2,25.75 v68.42,25.88 | 63.45,63.34 63.85,63.12 v63.98,63.34 | 63.45,63.34 63.85,63.56 v63.98,63.34 | 64.5,63.34 64.1,63.56 v63.98,63.34 | 64.5,63.34 64.1,63.12 v63.98,63.34 | 35.51,63.34 35.91,63.12 v36.04,63.34 | 35.51,63.34 35.91,63.56 v36.04,63.34 | 36.56,63.34 36.16,63.56 v36.04,63.34 | 36.56,63.34 36.16,63.12 v36.04,63.34
  Bottom 0.25: v63.98,63.34 63.45,63.34 | 63.45,63.34 36.56,63.34 | 36.56,63.34 v36.04,63.34 | v68.42,25.88 68.42,26.4 | 68.42,26.4 68.42,37.31 72.87,41.75 72.87,61.91 71.44,63.34 64.5,63.34 | 64.5,63.34 v63.98,63.34 | 68.42,26.4 68.2,26 v68.42,25.88 | 68.42,26.4 68.64,26 v68.42,25.88 | 63.45,63.34 63.85,63.12 v63.98,63.34 | 63.45,63.34 63.85,63.56 v63.98,63.34 | 64.5,63.34 64.1,63.56 v63.98,63.34 | 64.5,63.34 64.1,63.12 v63.98,63.34 | 36.56,63.34 36.16,63.56 v36.04,63.34 | 36.56,63.34 36.16,63.12 v36.04,63.34
SDA  (via drill 0.35)
  Top 0.25: 66.36,25.35 66.36,18.62 X2.13 66.44,17.22 67.15,16.51 70.96,16.51 71.6,15.88 R4.1 | 66.36,25.35 v66.36,25.88 | v63.98,61.44 63.45,61.44 | 63.45,61.44 62.18,61.44 X4.13 | v36.04,61.44 35.51,61.44 | 35.51,61.44 34.24,61.44 X3.13 | R20.1 66.2,60.17 64.93,61.44 64.5,61.44 | 64.5,61.44 v63.98,61.44 | v36.04,61.44 36.56,61.44 | 36.56,61.44 R15.1 | 66.36,25.35 66.58,25.75 v66.36,25.88 | 66.36,25.35 66.14,25.75 v66.36,25.88 | 63.45,61.44 63.85,61.21 v63.98,61.44 | 63.45,61.44 63.85,61.66 v63.98,61.44 | 64.5,61.44 64.1,61.66 v63.98,61.44 | 64.5,61.44 64.1,61.21 v63.98,61.44 | 35.51,61.44 35.91,61.21 v36.04,61.44 | 35.51,61.44 35.91,61.66 v36.04,61.44 | 36.56,61.44 36.16,61.66 v36.04,61.44 | 36.56,61.44 36.16,61.21 v36.04,61.44
  Bottom 0.25: v63.98,61.44 63.45,61.44 | 63.45,61.44 36.56,61.44 | 36.56,61.44 v36.04,61.44 | v63.98,61.44 64.5,61.44 | 64.5,61.44 71.12,61.44 72.23,60.33 72.23,41.75 66.36,35.88 66.36,26.4 | 66.36,26.4 v66.36,25.88 | 66.36,26.4 66.14,26 v66.36,25.88 | 66.36,26.4 66.58,26 v66.36,25.88 | 63.45,61.44 63.85,61.21 v63.98,61.44 | 63.45,61.44 63.85,61.66 v63.98,61.44 | 64.5,61.44 64.1,61.66 v63.98,61.44 | 64.5,61.44 64.1,61.21 v63.98,61.44 | 36.56,61.44 36.16,61.66 v36.04,61.44 | 36.56,61.44 36.16,61.21 v36.04,61.44
STATUS  (via drill 0.35)
  Top 0.25: R7.2 55.09,14.56 | 55.09,14.56 v55.09,15.08 | X2.6 62.45,30.7 61.91,30.16 57.2,30.16 | v56.67,30.16 57.2,30.16 | 55.09,14.56 55.31,14.96 v55.09,15.08 | 55.09,14.56 54.86,14.96 v55.09,15.08 | 57.2,30.16 56.8,30.38 v56.67,30.16 | 57.2,30.16 56.8,29.94 v56.67,30.16
  Bottom 0.25: v55.09,15.08 55.09,15.61 | 55.09,15.61 55.09,29.37 55.88,30.16 56.15,30.16 | 56.15,30.16 v56.67,30.16 | 55.09,15.61 54.86,15.2 v55.09,15.08 | 55.09,15.61 55.31,15.2 v55.09,15.08 | 56.15,30.16 56.55,29.94 v56.67,30.16 | 56.15,30.16 56.55,30.38 v56.67,30.16
VIN
  pour Top (no thermals): 0.95,31.59 0.95,10.95 3.65,10.95 3.65,18.26 2.7,18.26 2.54,18.26 2.54,20.8 2.54,29.84 4.45,29.84 4.45,31.59

### Text on the board
tNames: MASTER | BUZZER | GPIO2 | ERROR | GPIO14 | STATUS | GPIO12 | SDA | GPIO4 | SCL | GPIO5 | SLAVE 1, 2 | 3V3 | BOOT | RX | TX | RESET | GND | 3V3 | BOOT | RX | TX | RESET | GND | SDA | GPIO4 | SCL | GPIO5 | 3V3 | POWER | ERROR | BOOT | RX | TX | STATUS | RESET | GND | 12V | GND | F1 | Gateway vote V2.0 | Designed by: Lý Trần Quốc Uy
tStop: SLAVE1 | SLAVE2 | MASTER